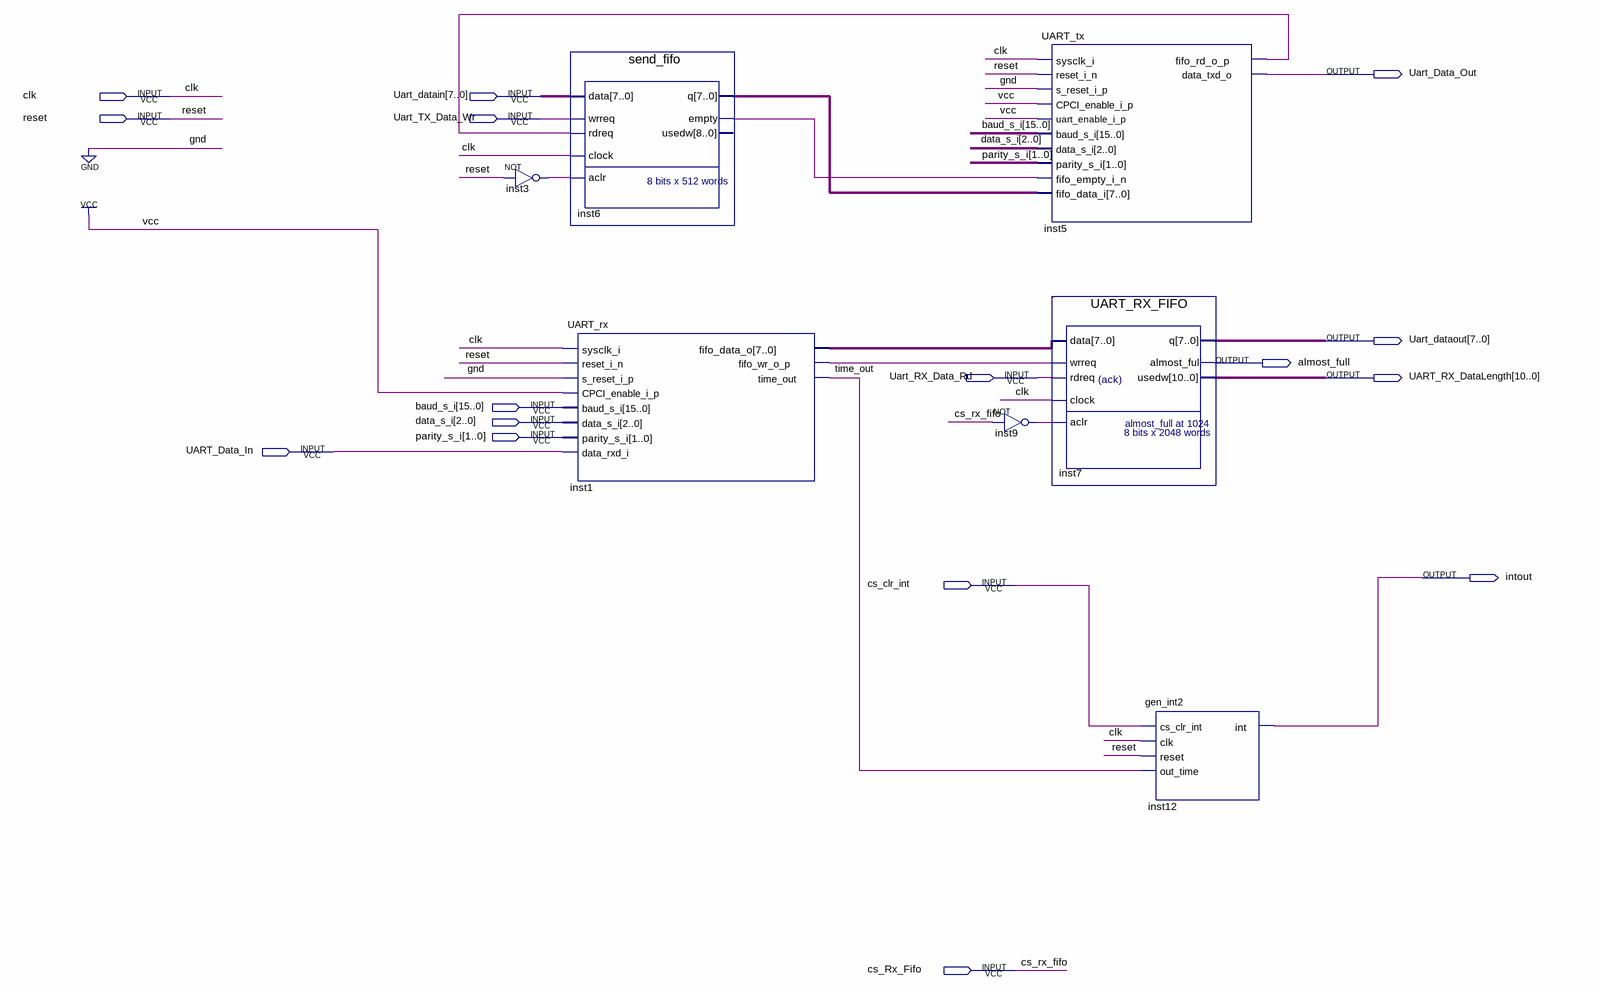
[diagram p0: schematic sheet]
// Quartus schematic UART_RXTX_MOD.bdf as structural Verilog: 7 symbols, 16 pins
module UART_RXTX_MOD (
  input  clk,
  input  [7:0] Uart_datain,
  input  reset,
  input  Uart_TX_Data_Wr,
  input  Uart_RX_Data_Rd,
  input  [15:0] baud_s_i,
  input  [2:0] data_s_i,
  input  [1:0] parity_s_i,
  input  UART_Data_In,
  input  cs_clr_int,
  input  cs_Rx_Fifo,
  output Uart_Data_Out,
  output [7:0] Uart_dataout,
  output almost_full,
  output [10:0] UART_RX_DataLength,
  output intout
);

  wire inst1_fifo_wr_o_p, inst3_out, inst5_fifo_rd_o_p, inst6_empty, inst9_out, time_out;
  wire [7:0] inst1_fifo_data_o, inst6_q;

  not inst3 (inst3_out, reset);
  send_fifo inst6 (
    .data(Uart_datain), .wrreq(Uart_TX_Data_Wr), .rdreq(inst5_fifo_rd_o_p), .clock(clk), .aclr(inst3_out),
    .q(inst6_q), .empty(inst6_empty));  // open: usedw
  UART_rx inst1 (
    .sysclk_i(clk), .reset_i_n(reset), .s_reset_i_p(1'b0), .CPCI_enable_i_p(1'b1), .baud_s_i(baud_s_i),
    .data_s_i(data_s_i), .parity_s_i(parity_s_i), .data_rxd_i(UART_Data_In), .fifo_data_o(inst1_fifo_data_o),
    .fifo_wr_o_p(inst1_fifo_wr_o_p), .time_out(time_out));
  not inst9 (inst9_out, cs_Rx_Fifo);
  UART_tx inst5 (
    .sysclk_i(clk), .reset_i_n(reset), .s_reset_i_p(1'b0), .CPCI_enable_i_p(1'b1), .uart_enable_i_p(1'b1),
    .baud_s_i(baud_s_i), .data_s_i(data_s_i), .parity_s_i(parity_s_i), .fifo_empty_i_n(inst6_empty),
    .fifo_data_i(inst6_q), .fifo_rd_o_p(inst5_fifo_rd_o_p), .data_txd_o(Uart_Data_Out));
  UART_RX_FIFO inst7 (
    .data(inst1_fifo_data_o), .wrreq(inst1_fifo_wr_o_p), .rdreq(Uart_RX_Data_Rd), .clock(clk),
    .aclr(inst9_out), .q(Uart_dataout), .almost_full(almost_full), .usedw(UART_RX_DataLength));
  gen_int2 inst12 (.cs_clr_int(cs_clr_int), .clk(clk), .reset(reset), .out_time(time_out), .\int (intout));
endmodule
